# Altium schematic sheet Э3.SchDoc: Блок охлаждения
size 420 x 297 mm; CheckedBy: Бойков; Author: Воропаева; CompanyName: РРБО-02-24; Address1: Address1; Address2: Address2; Address3: Address3; Address4: Address4; DocumentNumber: МРАГ.43 1122.500 Э3; SheetNumber: 1; SheetTotal: 1; DocumentType: Схема электрическая принципиальная; FirstReferrence: МРАГ.43 1122.500
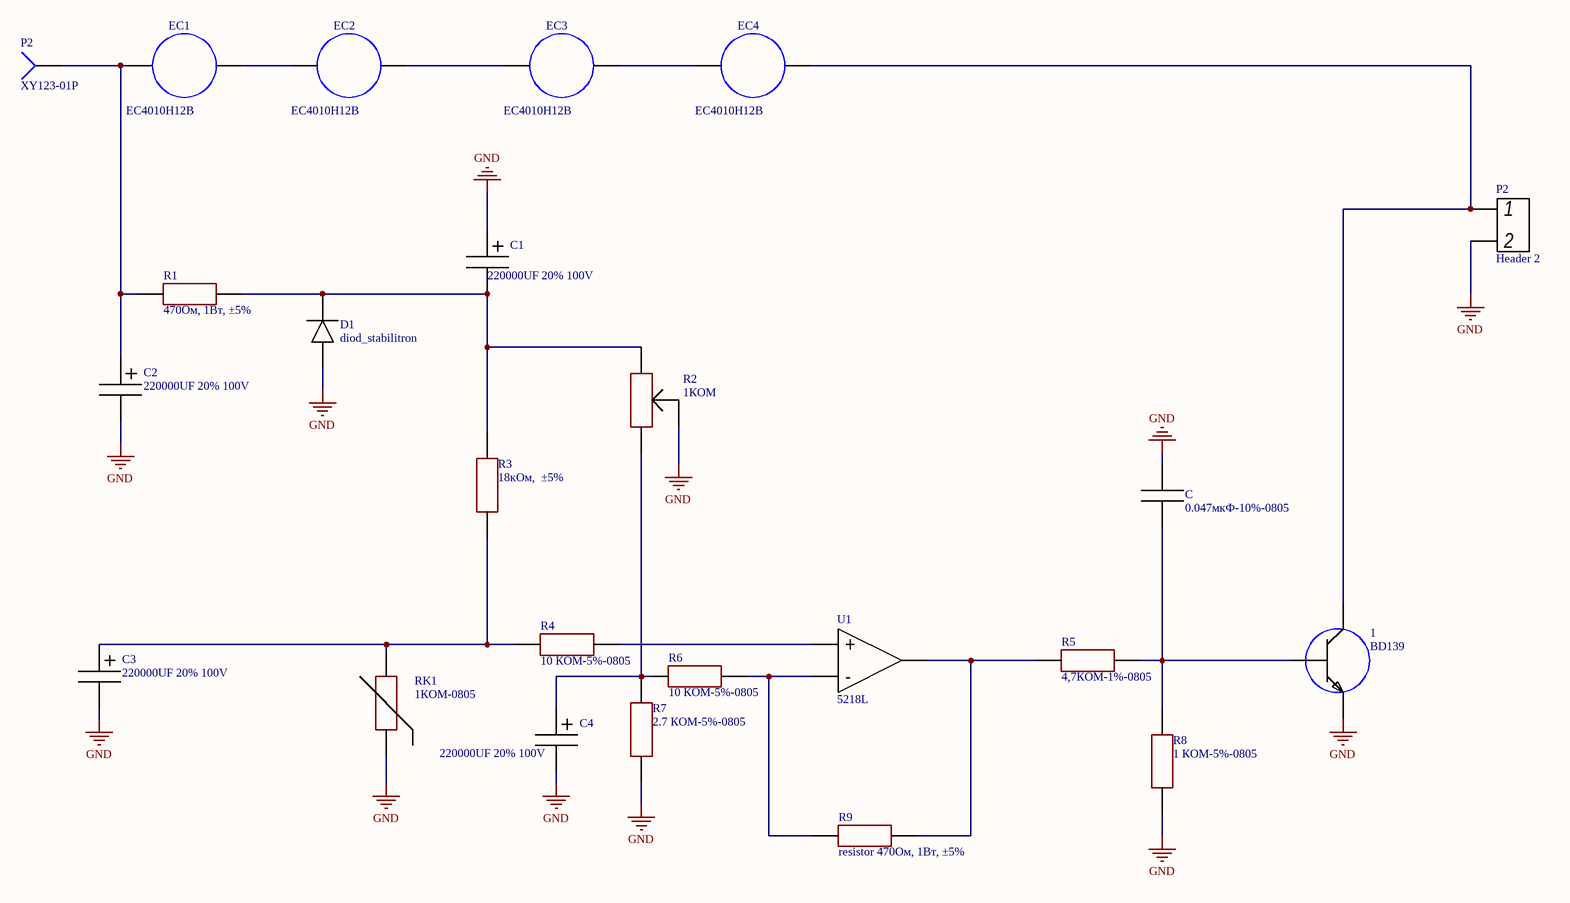
[diagram p0: Э3.SchDoc]

## Parts
(Parts that share a designator on the sheet are numbered #1, #2 ... from top to bottom, then left to right.)
1  BD139  [transistor]
C  0.047мкФ-10%-0805
D1  diod_stabilitron
EC1  EC4010H12B
EC2  EC4010H12B
EC3  EC4010H12B
EC4  EC4010H12B
P2#1  XY123-01P  [PIN1]
P2#2  Header 2
R1  470Ом, 1Вт, ±5%  [Resistor SMD 0805]
R2  1КОМ  [Resistor SMD 0805]
R3  18кОм,  ±5%  [Resistor SMD 0805]
R4  10 КОМ-5%-0805  [Resistor SMD 0805]
R5  4,7КОМ-1%-0805  [Resistor SMD 0805]
R6  10 КОМ-5%-0805  [Resistor SMD 0805]
R7  2.7 КОМ-5%-0805  [Resistor SMD 0805]
R8  1 КОМ-5%-0805  [Resistor SMD 0805]
R9  resistor 470Ом, 1Вт, ±5%  [Resistor SMD 0805]
RK1  1КОМ-0805  [Resistor SMD 0805]
U1  5218L
С1  220000UF 20% 100V
С2  220000UF 20% 100V
С3  220000UF 20% 100V
С4  220000UF 20% 100V

## Nets
GND: 1.3 C.2 D1.3 P2#2.4(2) R2.2 R7.3 R8.3 RK1.3 С1.3 С2.2 С3.2 С4.2
Net1_3: 1.3 EC4.3 P2#2.3(1)
Net1_4: 1.4 C.3 R5.2 R8.2
NetD1_3: D1.3 R1.2 R2.3 R3.2 С1.2
NetEC1_3: EC1.3 P2#1.1 R1.3 С2.3
NetEC1_3: EC1.3 EC2.3  [a separate net that carries the same name]
NetEC2_3: EC2.3 EC3.3
NetEC3_3: EC3.3 EC4.3
NetR2_2: R2.2 R6.3 R7.2 С4.3
NetR3_3: R3.3 R4.3 RK1.3 С3.3
NetR4_2: R4.2 U1.1(+)
NetR5_3: R5.3 R9.2 U1.0
NetR6_2: R6.2 R9.3 U1.2(-)

## Notes on the sheet
- Перв. примен.
- Справ. №
- Подп. и дата
- Инв. № дубл.
- Взам. инв. №
- Разраб.
- Изм.
- Лист
- № докум.
- Подп.
- Дата
- Лит.
- Масса
- Масштаб
- Пров.
- Т.контр.
- Листов
- Инв. № подл.
- Утв.
- Н.контр.
- 2.106-A3
- Копировал
- Формат А3

## Library data of the parts
1 = transistor: manufacture: STMicroelectronics; href: https://www.chipdip.ru/product/bd139-stm; partnamber: BD139
C = condensator: Condensator_SDM_0805; partnamber: MLCC0.047uFX7R50V10%0805; manufacture: Тайвань; Value: 0.047мкФ-10%-0805; href: https://www.chipdip.ru/product0/32272
D1 = diod_stabilitron: diod; manufacture: Diodes Incorporated; partnamber: D24V0S1U2TQ-7; href: https://www.chipdip.ru/product0/8004701593
EC1-EC4 = ventilator: ventilator 12В; Operating voltage: *; Pin: *; efficiency: *; partnamber: EC4010H12B; href: https://www.chipdip.ru/product/ec4010h12b?from=suggest_product
P2#1 = Socket: manufacture: Ningbo Xinya M&E; portnumber: XY123V-2.54-1P-14; LatestRevisionDate: 17-Jul-2002; LatestRevisionNote: Re-released for DXP Platform.; Publisher: Altium Limited; href: https://www.chipdip.ru/product/xy123-01p?utm_source=direct&utm_medium=cpc&utm_campaign=Y_dinamicheskaya&utm_content=text1_ya&utm_term=---autotargeting&position_type=premium&etext=2202.BJlwkJCtsc2iPl2l8AcNu2w34xO8na-B6UvzKP2fbPptbm5mdGtwY2pvb3puamNr.5ad2068e74d0529f82c720e105e143f7eb2b08ba&yclid=2787476848863870975
P2#2 = rasiom: partnamber: 826646-2; manufacture: TE Connectivity; href: https://www.chipdip.ru/product0/8006187918
R1 R9 = resistor_SMD0805: Manufacturer: ROYAL OHM; partnamber: KNPA1WJ0471A10; chrev: https://www.chipdip.ru/product0/9000856850
R2 = resistor peremen
R3 = resistor_SMD0805: partnamber: PMR03SJ0183A19; Производительность: Резистор: Power metal, THT, 18кОм, 3Вт, ±5%; chrev: https://www.chipdip.ru/product0/9001404636
R4 R6 = resistor_SMD0805: partnamber: CF-1W-10KJ; Производительность: 10кОм; chrev: https://www.chipdip.ru/product/cf-100-s1-4-1w-10-kom-5
R5 = resistor_SMD0805: partnamber: 0805 1% 4K7 RI0805L4701FT; Производительность: 1% 4K7; chrev: https://www.chipdip.ru/product0/8013449358?from=suggest_product
R7 = resistor_SMD0805: manufacture: Hottech; partnamber: 0805 5% 2K7 RI0805L272JT; value: resistor2.7 кОм-5%-0805; chrev: https://www.chipdip.ru/product0/8009027056?from=suggest_product
R8 = resistor_SMD0805: partnamber: 0805 5% 1K RI0805L102JT; Производительность: 0805 5% 1K; chrev: https://www.chipdip.ru/product0/8009027047
RK1 = resistor temerature: partnamber: NCP21WF104J03RA; manufacture: Murata Electronics; value: 0805 5% 100KОм; temperature: -40...125; href: https://www.chipdip.ru/product/ncp21wf104j03ra
U1 = operasion_ysil: manufacture: Texas Instruments; partnumber: 2056938333; href: https://www.chipdip.ru/product/drv135ua
С1-С4 = condensator+: partnamber: LNR2A224MSE; manufacture: Nichicon Corp.; href: https://www.chipdip.ru/product0/8005615214?from=suggest_product